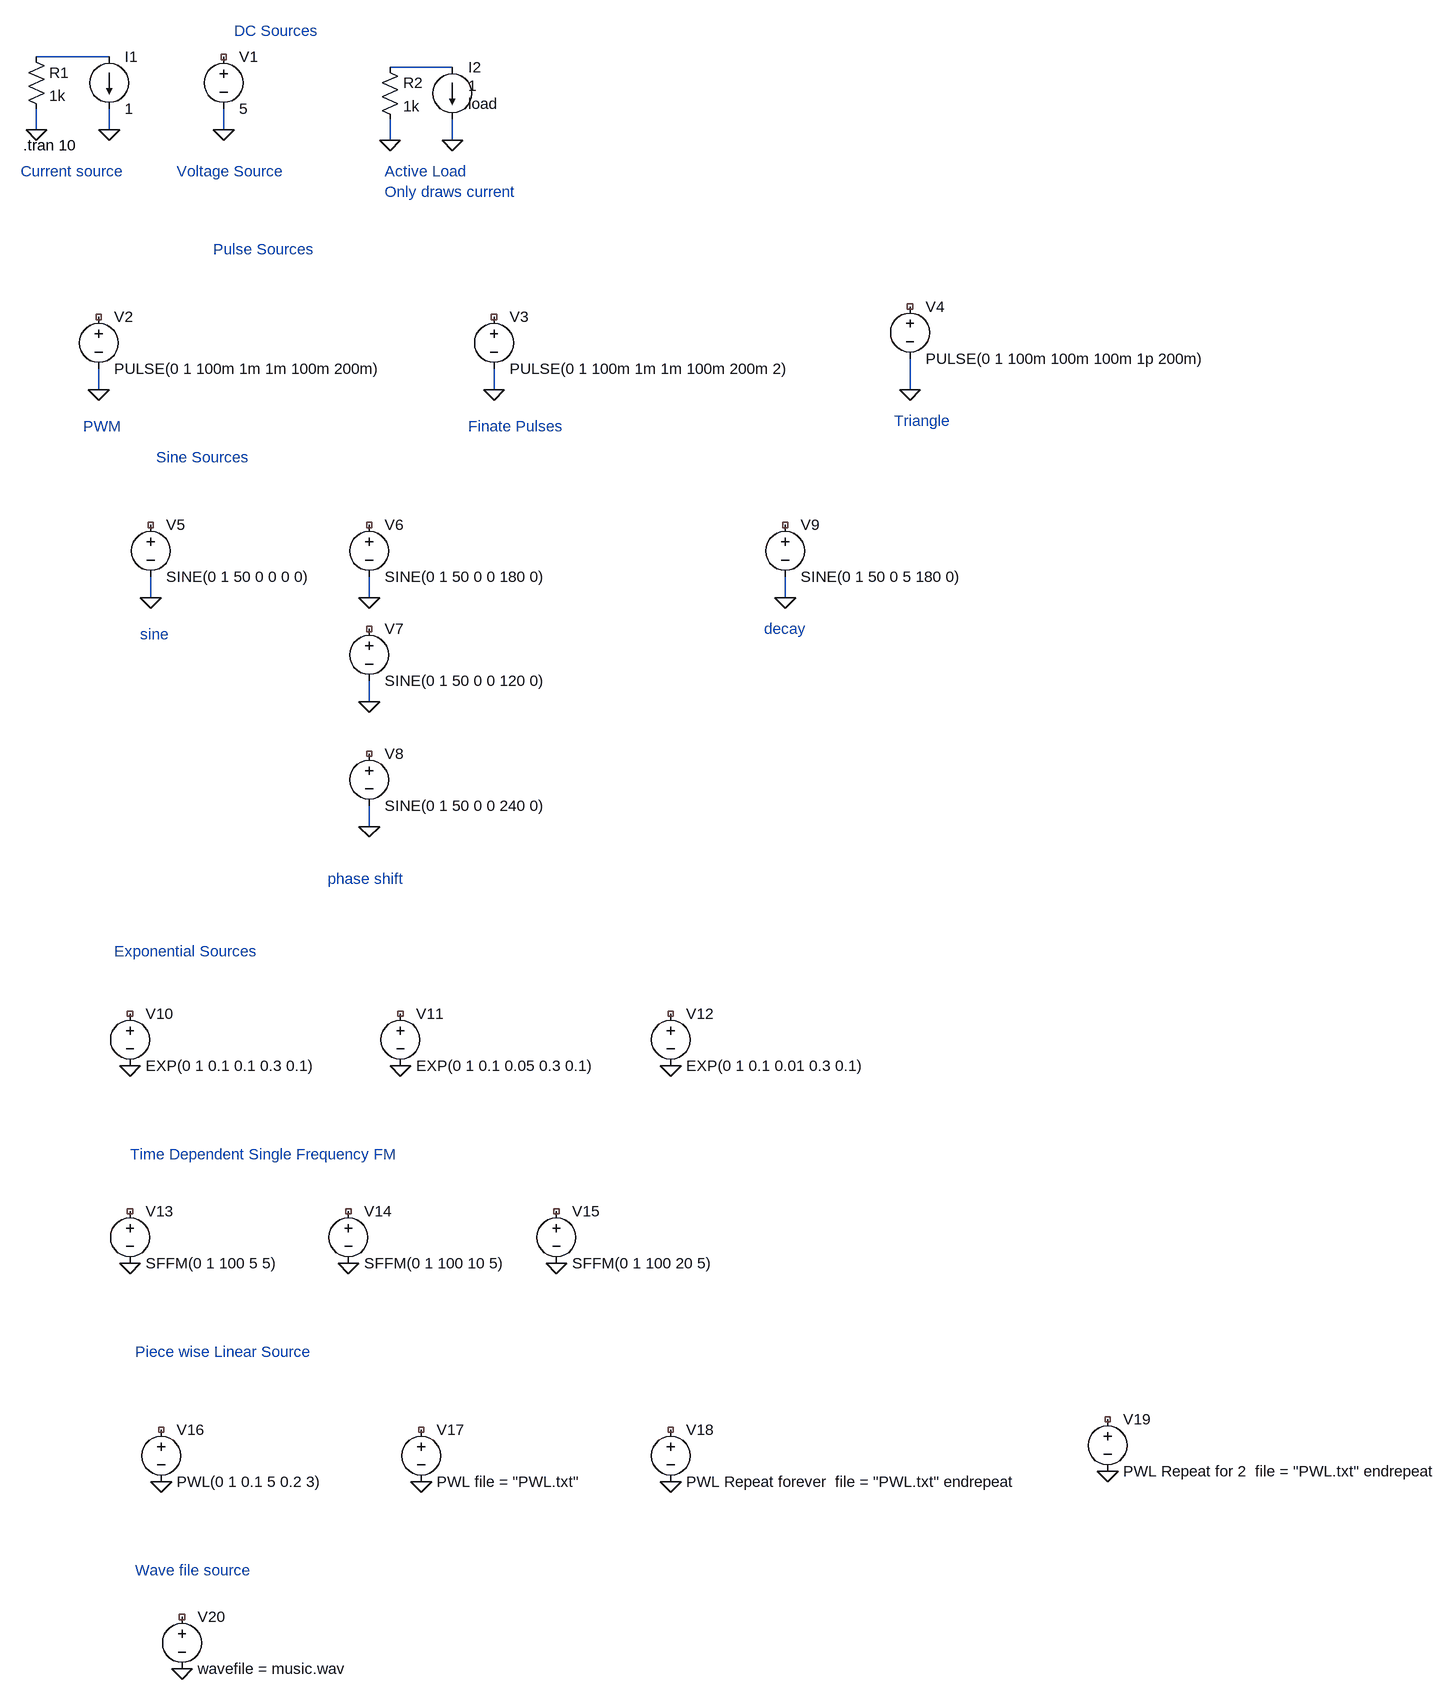
[diagram p0: schematic Draft1.asc]
Draft1.asc, the LTspice schematic file:
Version 4
SHEET 1 2552 1940
WIRE 16 -560 -96 -560
WIRE 544 -544 448 -544
WIRE -96 -448 -96 -480
WIRE 16 -448 16 -480
WIRE 192 -448 192 -480
WIRE 448 -432 448 -464
WIRE 544 -432 544 -464
WIRE 0 -48 0 -80
WIRE 608 -48 608 -80
WIRE 1248 -48 1248 -96
WIRE 80 272 80 240
WIRE 416 272 416 240
WIRE 1056 272 1056 240
WIRE 416 432 416 400
WIRE 416 624 416 592
FLAG 16 -448 0
FLAG -96 -448 0
FLAG 192 -448 0
FLAG 448 -432 0
FLAG 544 -432 0
FLAG 0 -48 0
FLAG 608 -48 0
FLAG 1248 -48 0
FLAG 80 272 0
FLAG 416 272 0
FLAG 1056 272 0
FLAG 416 432 0
FLAG 416 624 0
FLAG 48 992 0
FLAG 464 992 0
FLAG 880 992 0
FLAG 48 1296 0
FLAG 384 1296 0
FLAG 704 1296 0
FLAG 96 1632 0
FLAG 496 1632 0
FLAG 880 1632 0
FLAG 1552 1616 0
FLAG 128 1920 0
SYMBOL current 16 -560 R0
WINDOW 123 0 0 Left 0
WINDOW 39 0 0 Left 0
SYMATTR InstName I1
SYMATTR Value 1
SYMBOL voltage 192 -576 R0
WINDOW 123 0 0 Left 0
WINDOW 39 0 0 Left 0
SYMATTR InstName V1
SYMATTR Value 5
SYMBOL res -112 -576 R0
SYMATTR InstName R1
SYMATTR Value 1k
SYMBOL current 544 -544 R0
WINDOW 3 24 28 Left 2
WINDOW 123 0 0 Left 0
WINDOW 39 24 56 Left 2
SYMATTR InstName I2
SYMATTR Value 1
SYMATTR SpiceLine load
SYMBOL res 432 -560 R0
SYMATTR InstName R2
SYMATTR Value 1k
SYMBOL voltage 0 -176 R0
WINDOW 123 0 0 Left 0
WINDOW 39 0 0 Left 0
SYMATTR InstName V2
SYMATTR Value PULSE(0 1 100m 1m 1m 100m 200m)
SYMBOL voltage 608 -176 R0
WINDOW 123 0 0 Left 0
WINDOW 39 0 0 Left 0
SYMATTR InstName V3
SYMATTR Value PULSE(0 1 100m 1m 1m 100m 200m 2)
SYMBOL voltage 1248 -192 R0
WINDOW 123 0 0 Left 0
WINDOW 39 0 0 Left 0
SYMATTR InstName V4
SYMATTR Value PULSE(0 1 100m 100m 100m 1p 200m)
SYMBOL voltage 80 144 R0
WINDOW 123 0 0 Left 0
WINDOW 39 0 0 Left 0
SYMATTR InstName V5
SYMATTR Value SINE(0 1 50 0 0 0 0)
SYMBOL voltage 416 144 R0
WINDOW 123 0 0 Left 0
WINDOW 39 0 0 Left 0
SYMATTR InstName V6
SYMATTR Value SINE(0 1 50 0 0 180 0)
SYMBOL voltage 1056 144 R0
WINDOW 123 0 0 Left 0
WINDOW 39 0 0 Left 0
SYMATTR InstName V9
SYMATTR Value SINE(0 1 50 0 5 180 0)
SYMBOL voltage 416 304 R0
WINDOW 123 0 0 Left 0
WINDOW 39 0 0 Left 0
SYMATTR InstName V7
SYMATTR Value SINE(0 1 50 0 0 120 0)
SYMBOL voltage 416 496 R0
WINDOW 123 0 0 Left 0
WINDOW 39 0 0 Left 0
SYMATTR InstName V8
SYMATTR Value SINE(0 1 50 0 0 240 0)
SYMBOL voltage 48 896 R0
WINDOW 123 0 0 Left 0
WINDOW 39 0 0 Left 0
SYMATTR InstName V10
SYMATTR Value EXP(0 1 0.1 0.1 0.3 0.1)
SYMBOL voltage 464 896 R0
WINDOW 123 0 0 Left 0
WINDOW 39 0 0 Left 0
SYMATTR InstName V11
SYMATTR Value EXP(0 1 0.1 0.05 0.3 0.1)
SYMBOL voltage 880 896 R0
WINDOW 123 0 0 Left 0
WINDOW 39 0 0 Left 0
SYMATTR InstName V12
SYMATTR Value EXP(0 1 0.1 0.01 0.3 0.1)
SYMBOL voltage 48 1200 R0
WINDOW 123 0 0 Left 0
WINDOW 39 0 0 Left 0
SYMATTR InstName V13
SYMATTR Value SFFM(0 1 100 5 5)
SYMBOL voltage 384 1200 R0
WINDOW 123 0 0 Left 0
WINDOW 39 0 0 Left 0
SYMATTR InstName V14
SYMATTR Value SFFM(0 1 100 10 5)
SYMBOL voltage 704 1200 R0
WINDOW 123 0 0 Left 0
WINDOW 39 0 0 Left 0
SYMATTR InstName V15
SYMATTR Value SFFM(0 1 100 20 5)
SYMBOL voltage 96 1536 R0
WINDOW 123 0 0 Left 0
WINDOW 39 0 0 Left 0
SYMATTR InstName V16
SYMATTR Value PWL(0 1 0.1 5 0.2 3)
SYMBOL voltage 496 1536 R0
WINDOW 123 0 0 Left 0
WINDOW 39 0 0 Left 0
SYMATTR InstName V17
SYMATTR Value PWL file = "PWL.txt"
SYMBOL voltage 880 1536 R0
WINDOW 123 0 0 Left 0
WINDOW 39 0 0 Left 0
SYMATTR InstName V18
SYMATTR Value PWL Repeat forever  file = "PWL.txt" endrepeat
SYMBOL voltage 1552 1520 R0
WINDOW 123 0 0 Left 0
WINDOW 39 0 0 Left 0
SYMATTR InstName V19
SYMATTR Value PWL Repeat for 2  file = "PWL.txt" endrepeat
SYMBOL voltage 128 1824 R0
SYMATTR InstName V20
SYMATTR Value wavefile = music.wav
TEXT -116 -424 Left 2 !.tran 10
TEXT -120 -384 Left 2 ;Current source
TEXT 120 -384 Left 2 ;Voltage Source
TEXT 440 -384 Left 2 ;Active Load\nOnly draws current
TEXT 208 -600 Left 2 ;DC Sources
TEXT 176 -264 Left 2 ;Pulse Sources
TEXT -24 8 Left 2 ;PWM
TEXT 568 8 Left 2 ;Finate Pulses
TEXT 1224 0 Left 2 ;Triangle
TEXT 88 56 Left 2 ;Sine Sources
TEXT 64 328 Left 2 ;sine
TEXT 352 704 Left 2 ;phase shift
TEXT 1024 320 Left 2 ;decay
TEXT 24 816 Left 2 ;Exponential Sources
TEXT 48 1128 Left 2 ;Time Dependent Single Frequency FM
TEXT 56 1432 Left 2 ;Piece wise Linear Source
TEXT 56 1768 Left 2 ;Wave file source

The netlist it stands for:
* Draft1.asc
I1 N001 0 1
V1 NC_01 0 5
R1 N001 0 1k
I2 N002 0 1 load
R2 N002 0 1k
V2 NC_02 0 PULSE(0 1 100m 1m 1m 100m 200m)
V3 NC_03 0 PULSE(0 1 100m 1m 1m 100m 200m 2)
V4 NC_04 0 PULSE(0 1 100m 100m 100m 1p 200m)
V5 NC_05 0 SINE(0 1 50 0 0 0 0)
V6 NC_06 0 SINE(0 1 50 0 0 180 0)
V9 NC_07 0 SINE(0 1 50 0 5 180 0)
V7 NC_08 0 SINE(0 1 50 0 0 120 0)
V8 NC_09 0 SINE(0 1 50 0 0 240 0)
V10 NC_10 0 EXP(0 1 0.1 0.1 0.3 0.1)
V11 NC_11 0 EXP(0 1 0.1 0.05 0.3 0.1)
V12 NC_12 0 EXP(0 1 0.1 0.01 0.3 0.1)
V13 NC_13 0 SFFM(0 1 100 5 5)
V14 NC_14 0 SFFM(0 1 100 10 5)
V15 NC_15 0 SFFM(0 1 100 20 5)
V16 NC_16 0 PWL(0 1 0.1 5 0.2 3)
V17 NC_17 0 PWL file = "PWL.txt"
V18 NC_18 0 PWL Repeat forever  file = "PWL.txt" endrepeat
V19 NC_19 0 PWL Repeat for 2  file = "PWL.txt" endrepeat
V20 NC_20 0 wavefile = music.wav
.tran 10
* Current source
* Voltage Source
* Active Load
* Only draws current
* DC Sources
* Pulse Sources
* PWM
* Finate Pulses
* Triangle
* Sine Sources
* sine
* phase shift
* decay
* Exponential Sources
* Time Dependent Single Frequency FM
* Piece wise Linear Source
* Wave file source
.backanno
.end